# EasyEDA Pro project 红外对管感应模块.eprj

# Schematic Schematic2
Page Name: p1_1; Project Name: 红外对管感应模块; Schematic Name: Schematic2; Update Date: 2023-04-21; Company: 嘉立创EDA; Page Size: A4; Version: V1.0
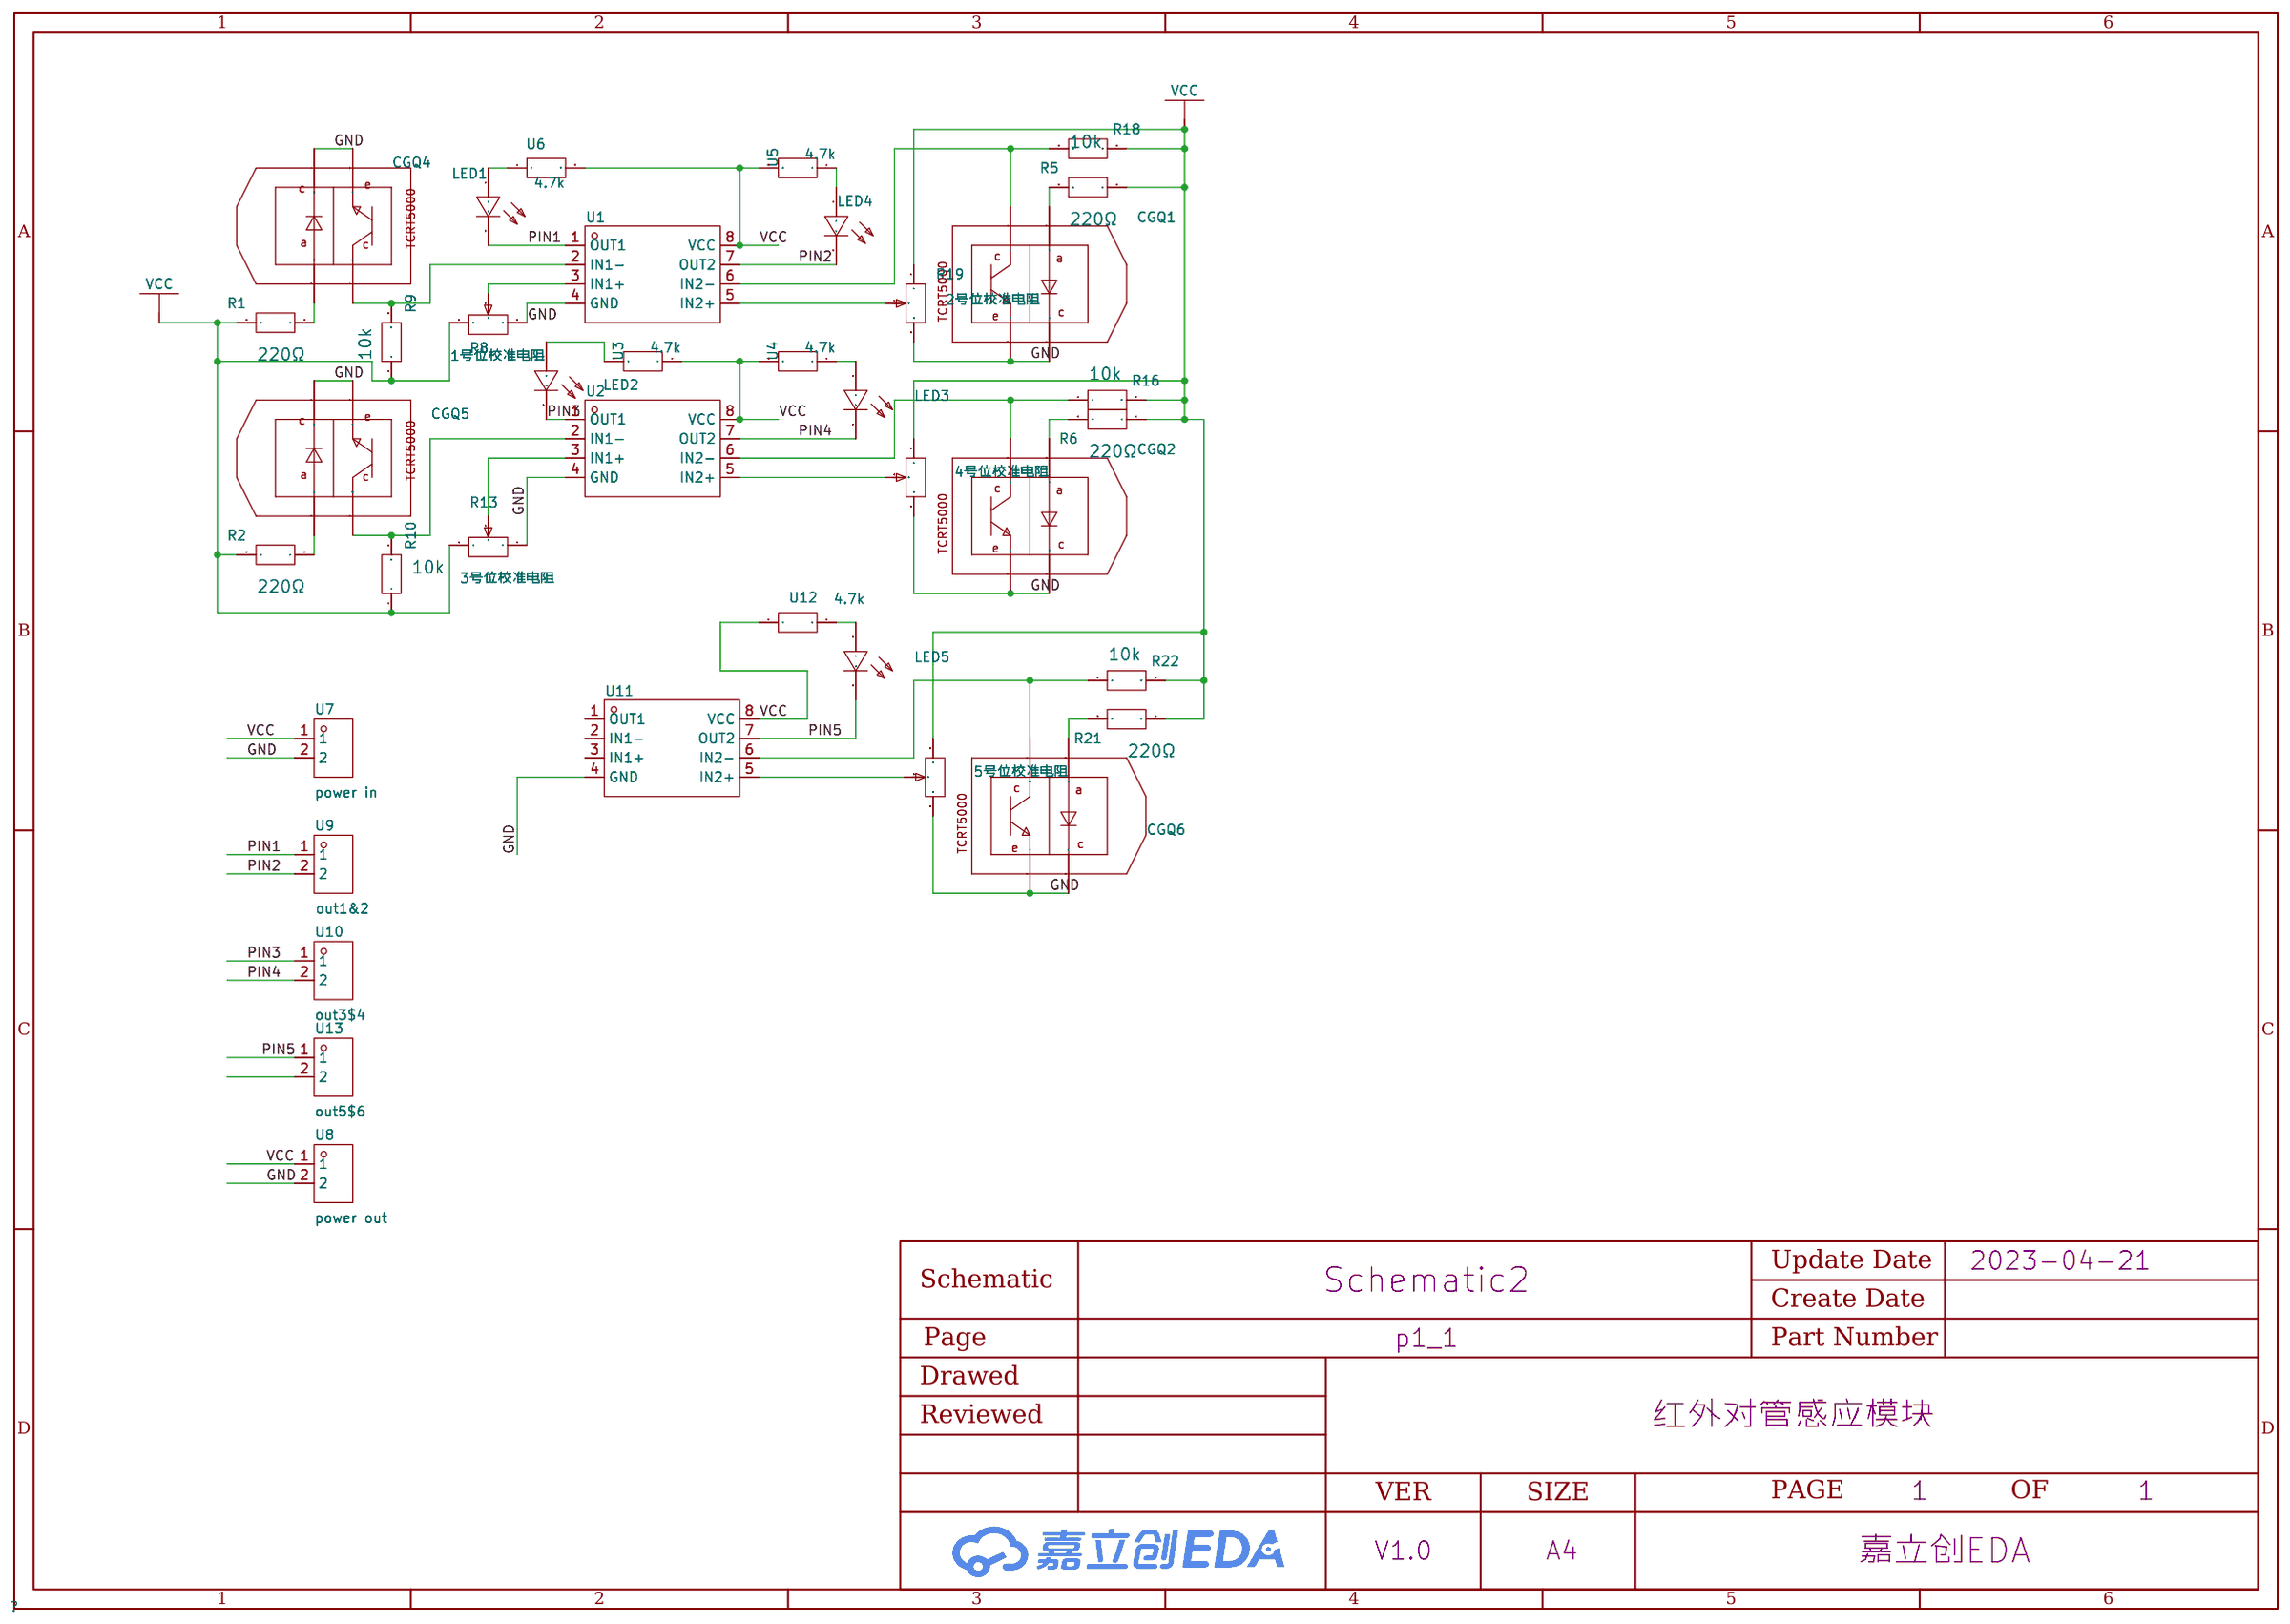
[diagram p0: schematic sheet]

## Parts
CGQ1  -  [opto-th_tcrt5000l]
CGQ2  -  [opto-th_tcrt5000l]
CGQ4  -  [opto-th_tcrt5000l]
CGQ5  -  [opto-th_tcrt5000l]
CGQ6  -  [opto-th_tcrt5000l]
LED1  -  [led-th_bd3.8-p2.54-fd]
LED2  -  [led-th_bd3.8-p2.54-fd]
LED3  -  [led-th_bd3.8-p2.54-fd]
LED4  -  [led-th_bd3.8-p2.54-fd]
LED5  -  [led-th_bd3.8-p2.54-fd]
R1  220Ω  [直插电阻]
R2  220Ω  [直插电阻]
R5  220Ω  [直插电阻]
R6  220Ω  [直插电阻]
R8  1号位校准电阻  [res-adj-th_3296w]
R9  10k  [直插电阻]
R10  10k  [直插电阻]
R13  3号位校准电阻  [res-adj-th_3296w]
R16  10k  [直插电阻]
R18  10k  [直插电阻]
R19  2号位校准电阻  [res-adj-th_3296w]
R20  4号位校准电阻  [res-adj-th_3296w]
R21  220Ω  [直插电阻]
R22  10k  [直插电阻]
R23  5号位校准电阻  [res-adj-th_3296w]
U1  -  [dip-8_l9.7-w6.4-p2.54-ls7.6-bl]
U2  -  [dip-8_l9.7-w6.4-p2.54-ls7.6-bl]
U3  4.7k  [直插电阻]
U4  4.7k  [直插电阻]
U5  4.7k  [直插电阻]
U6  4.7k  [直插电阻]
U7  power in  [hdr-th_2p-p2.54-v-m-1]
U8  power out  [hdr-th_2p-p2.54-v-m-1]
U9  out1&2  [hdr-th_2p-p2.54-v-m-1]
U10  out3$4  [hdr-th_2p-p2.54-v-m-1]
U11  -  [dip-8_l9.7-w6.4-p2.54-ls7.6-bl]
U12  4.7k  [直插电阻]
U13  out5$6  [hdr-th_2p-p2.54-v-m-1]

## Library data of the parts
CGQ1 CGQ2 CGQ4-CGQ6 = TCRT5000L: 950 nm 60 mA Through Hole Reflective Optical Sensor with Transistor Output; Supplier Part: C24085; Manufacturer: VISHAY(威世); Supplier Footprint: Through Hole; Datasheet: https://atta.szlcsc.com/upload/public/pdf/source/20150821/1457707346389.pdf; Supplier: LCSC
LED1-LED5 = 204-10SDRD/S530-A3-L: 发光颜色:红灯;; LCSC Part Name: 3MM  红发红光; Supplier Part: C84774; Manufacturer: EVERLIGHT(台湾亿光); Supplier Footprint: 插件; JLCPCB Part Class: Extended Part; Datasheet: https://atta.szlcsc.com/upload/public/pdf/source/20170717/C84774_1500286941158822251.pdf; Supplier: LCSC; Emitted Color: 红灯
R1 R2 R5 R6 R21 = 直插电阻: 220
R8 R13 R19 R20 R23 = 精密可调电阻 3296W-1-304(300K): LCSC Part Name: 精密可调电阻  3296W-1-304(300K); Supplier Part: C62174; Supplier Footprint: VR-3296W; Datasheet: https://atta.szlcsc.com/upload/public/pdf/source/20151126/1457707595819.pdf; Supplier: LCSC
R9 = 直插电阻
R10 R16 R18 R22 = 直插电阻10k
U1 U2 U11 = LM393N: 比较器组数:-;电源电压:-;各通道供电电流:-;输出类型:-;传播延迟:-;; LCSC Part Name: 双路差动比较器; Supplier Part: C725322; Manufacturer: HGSEMI(华冠); Supplier Footprint: DIP-8; Datasheet: https://atta.szlcsc.com/upload/public/pdf/source/20200820/C725322_C46EBBBE971B817B9F055C15254D1754.pdf; Supplier: LCSC
U3-U6 U12 = OX472KE: 电阻类型:陶瓷电阻;阻值:4.7k;精度:±10%;功率:1W;温度系数:-1600ppm/~-1000ppm/;工作温度范围:-40~+220;; LCSC Part Name: 4.7k ±10% 1W; Supplier Part: C2641721; Manufacturer: Ohmite; Supplier Footprint: 轴向引线,5.5x16.5mm; Datasheet: https://atta.szlcsc.com/upload/public/pdf/source/20210702/B1DB536FBEB5B0B19FA106C617F6E1C9.pdf; Supplier: LCSC; Type: 陶瓷电阻; Tolerance: ±10%; Power(Watts): 1W; Temperature Coefficient: -1600ppm/~-1000ppm/; Operating Temperature Range: -40~+220
U7-U10 U13 = HDR1X2: Supplier Part: C9900014921; Supplier Footprint: 排针; Datasheet: https://atta.szlcsc.comnull; Supplier: LCSC

## Nets
GND: CGQ1.2(E) CGQ1.4(C) CGQ2.2(E) CGQ2.4(C) CGQ4.2(E) CGQ4.4(C) CGQ5.2(E) CGQ5.4(C) CGQ6.2(E) CGQ6.4(C) R8.1 R13.1 R19.3 R20.3 R23.3 U1.4(GND) U2.4(GND) U7.2 U8.2 U11.4(GND)
VCC: R1.2 R2.2 R5.1 R6.1 R8.3 R9.1 R10.1 R13.3 R16.2 R18.2 R19.1 R20.1 R21.1 R22.2 R23.1 U1.8(VCC) U2.8(VCC) U3.1 U4.2 U5.2 U6.2 U7.1 U8.1 U11.8(VCC) U12.2
PIN1: LED1.2(C) U1.1(OUT1) U9.1
PIN2: LED4.2(C) U1.7(OUT2) U9.2
PIN3: LED2.2(C) U2.1(OUT1) U10.1
PIN4: LED3.2(C) U2.7(OUT2) U10.2
PIN5: LED5.2(C) U11.7(OUT2) U13.1
$3N2055: CGQ4.3(A) R1.1
$3N2059: CGQ5.3(A) R2.1
$3N2549: CGQ1.3(A) R5.2
$3N2554: CGQ2.3(A) R6.2
$3N2706: CGQ4.1(C) R9.2 U1.2(IN1-)
$3N4107: CGQ5.1(C) R10.2 U2.2(IN1-)
$3N4588: R13.2 U2.3(IN1+)
$3N7184: CGQ2.1(C) R16.1 U2.6(IN2-)
$3N7213: CGQ1.1(C) R18.1 U1.6(IN2-)
$3N7681: R19.2 U1.5(IN2+)
$3N9269: R20.2 U2.5(IN2+)
$3N15684: LED1.1(A) U6.1
$3N15894: LED2.1(A) U3.2
$3N16954: LED3.1(A) U4.1
$3N17558: LED4.1(A) U5.1
$3N17687: R8.2 U1.3(IN1+)
Net-(CGQ6-1): CGQ6.1(C) R22.1 U11.6(IN2-)
Net-(CGQ6-3): CGQ6.3(A) R21.2
Net-(LED5-1): LED5.1(A) U12.1
Net-(R23-2): R23.2 U11.5(IN2+)

Not connected (* = marked no-connect by the designer): U11 1(OUT1) 2(IN1-) 3(IN1+); U13 2

# Schematic Schematic3
Create Date: 2023-04-21; Page Name: P1; Project Name: 红外对管感应模块; Schematic Name: Schematic3; Update Date: 2023-04-23; Company: 嘉立创EDA; Page Size: A4; Version: V1.0
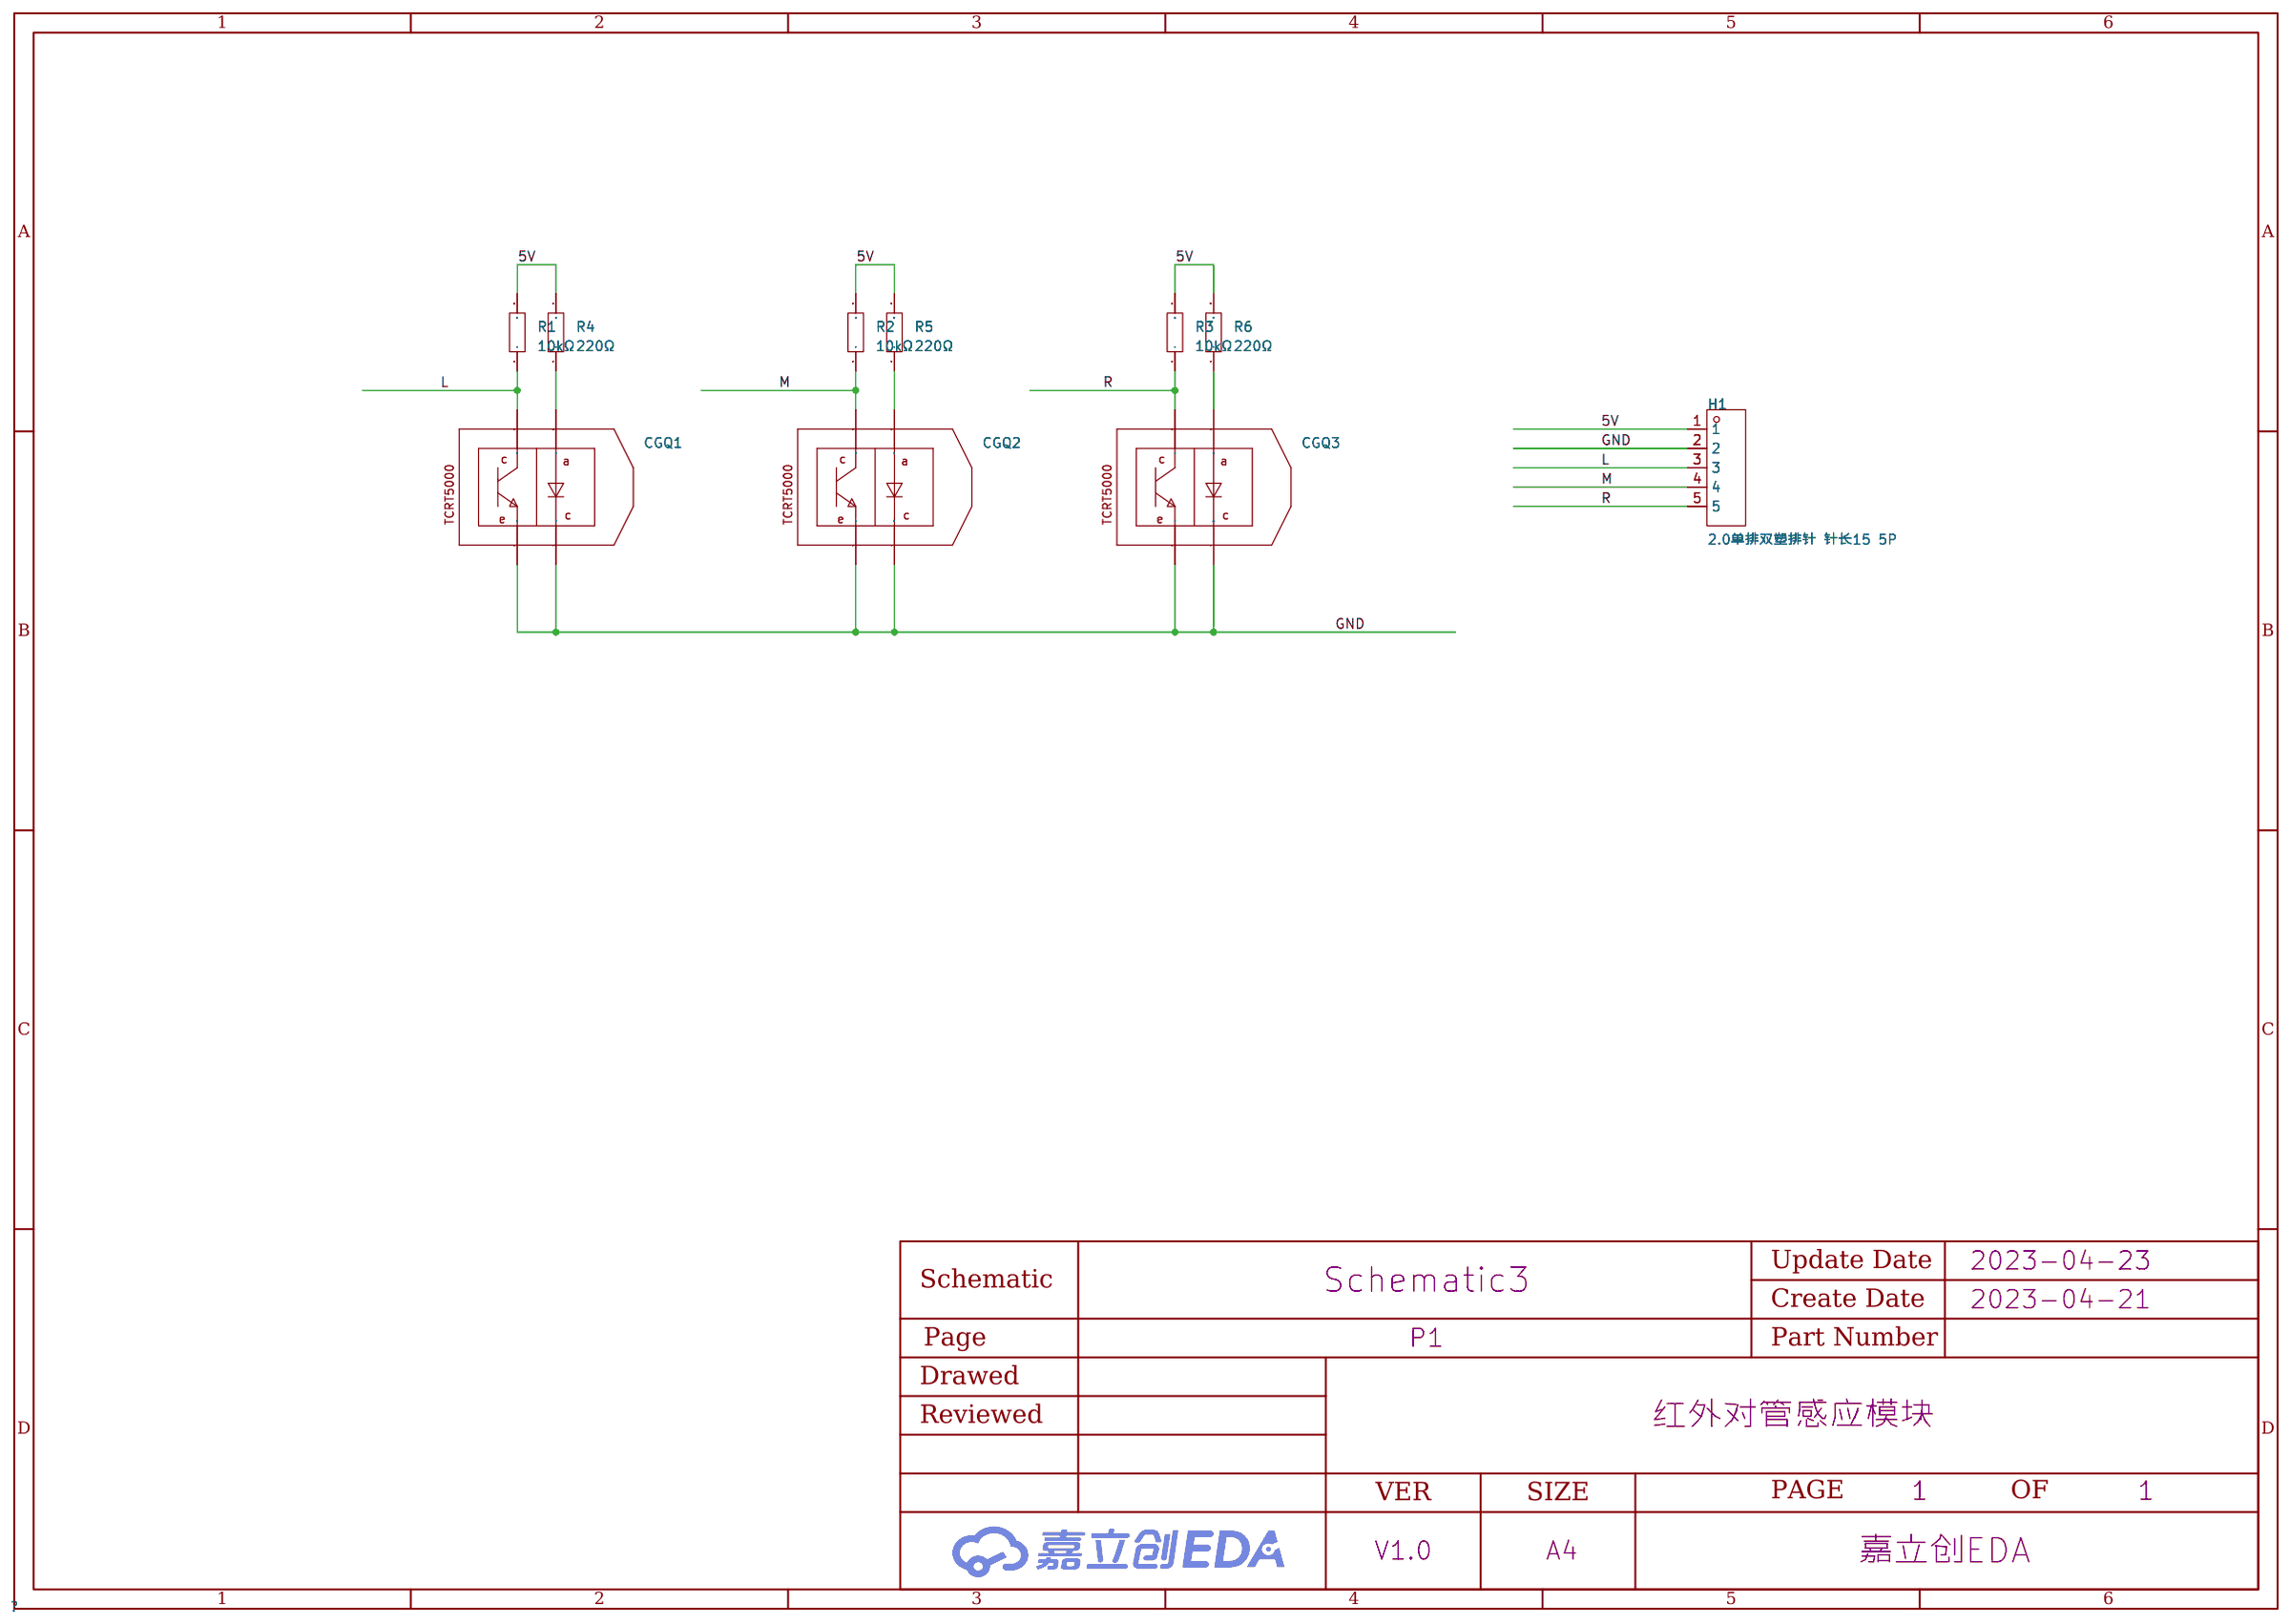
[diagram p1: schematic sheet]

## Parts
CGQ1  -  [opto-th_tcrt5000l]
CGQ2  -  [opto-th_tcrt5000l]
CGQ3  -  [opto-th_tcrt5000l]
H1  2.0单排双塑排针 针长15 5P  [HDR-TH_5P-P2.00-V-M]
R1  10kΩ  [Res_1/8W]
R2  10kΩ  [Res_1/8W]
R3  10kΩ  [Res_1/8W]
R4  220Ω  [Res_1/8W]
R5  220Ω  [Res_1/8W]
R6  220Ω  [Res_1/8W]

## Library data of the parts
CGQ1-CGQ3 = TCRT5000L: 950 nm 60 mA Through Hole Reflective Optical Sensor with Transistor Output; Supplier Part: C24085; Manufacturer: VISHAY(威世); Supplier Footprint: Through Hole; Datasheet: https://atta.szlcsc.com/upload/public/pdf/source/20150821/1457707346389.pdf; Supplier: LCSC
H1 = 2.0单排双塑排针 针长15 5P: Supplier Part: C9900020043; JLCPCB Part Class: Extended Part; Datasheet: https://atta.szlcsc.comnull; Supplier: LCSC
R1-R6 = Res_AXIAL-1/8W: Supplier Footprint: 轴向引线

## Nets
5V: H1.1 R1.2 R2.2 R3.2 R4.2 R5.2 R6.2
GND: CGQ1.2(E) CGQ1.4(C) CGQ2.2(E) CGQ2.4(C) CGQ3.2(E) CGQ3.4(C) H1.2
L: CGQ1.1(C) H1.3 R1.1
M: CGQ2.1(C) H1.4 R2.1
R: CGQ3.1(C) H1.5 R3.1
$1N2421: CGQ1.3(A) R4.1
$1N2492: CGQ2.3(A) R5.1
$1N2520: CGQ3.3(A) R6.1

# Board PCB
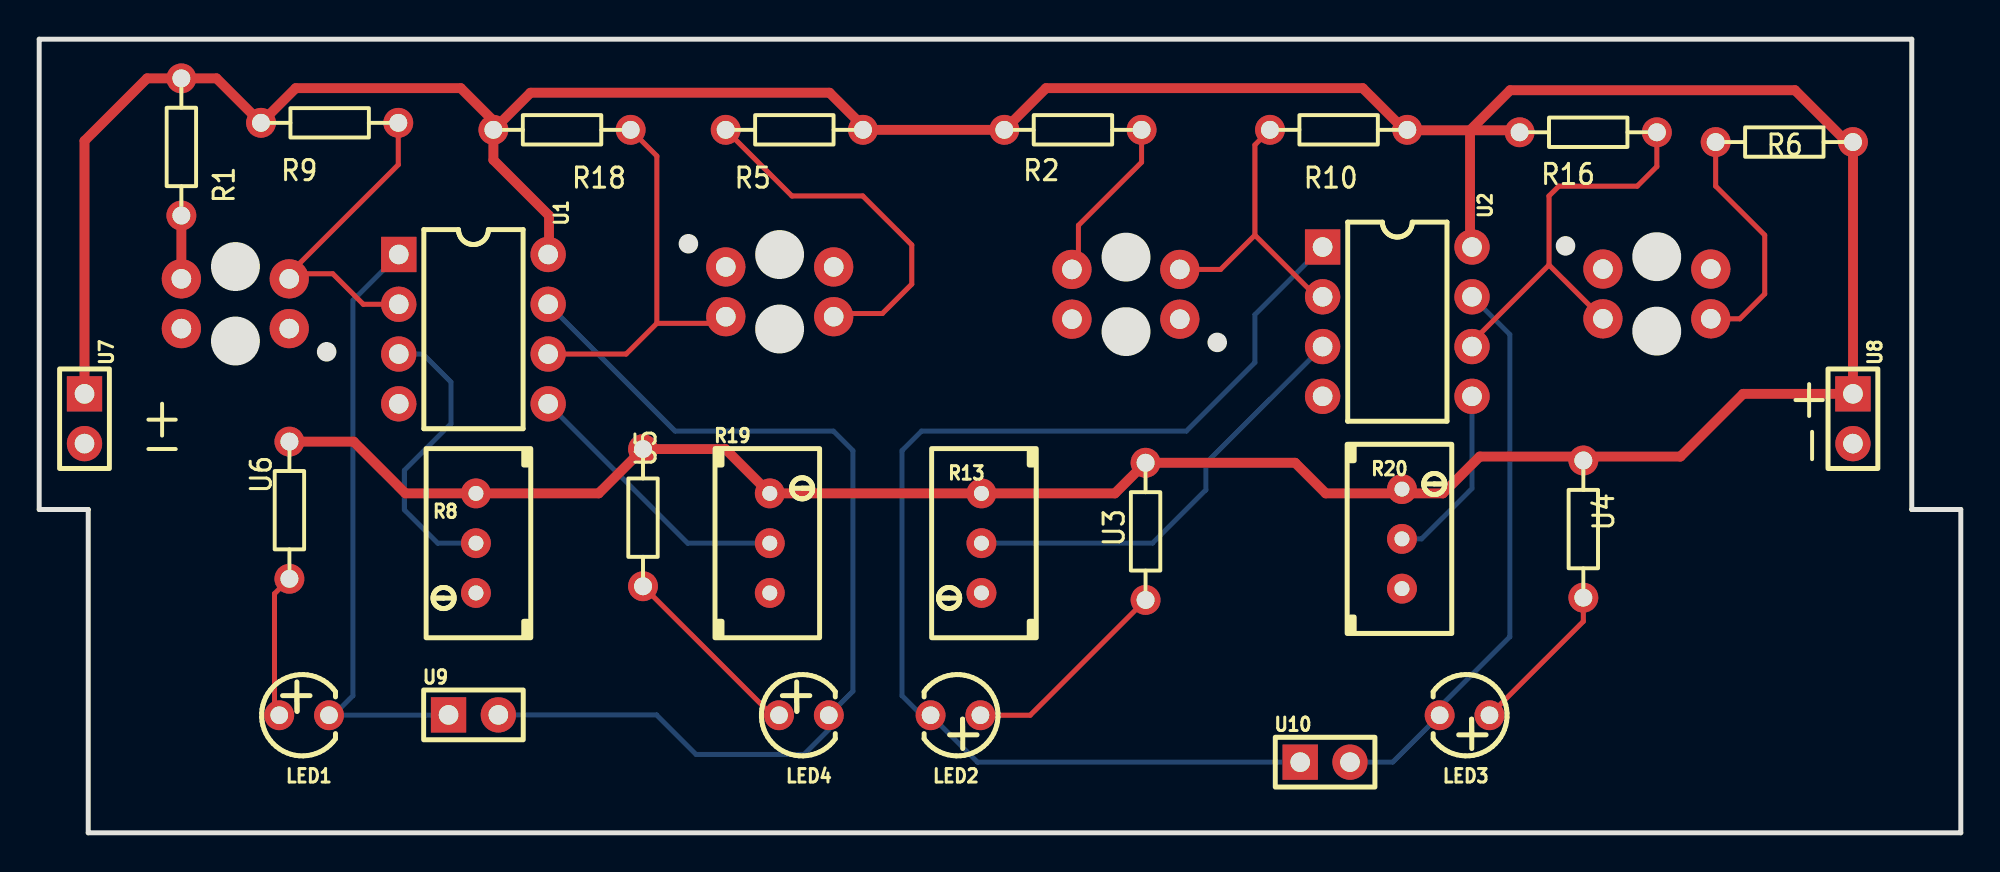
[diagram p2: board, top side]
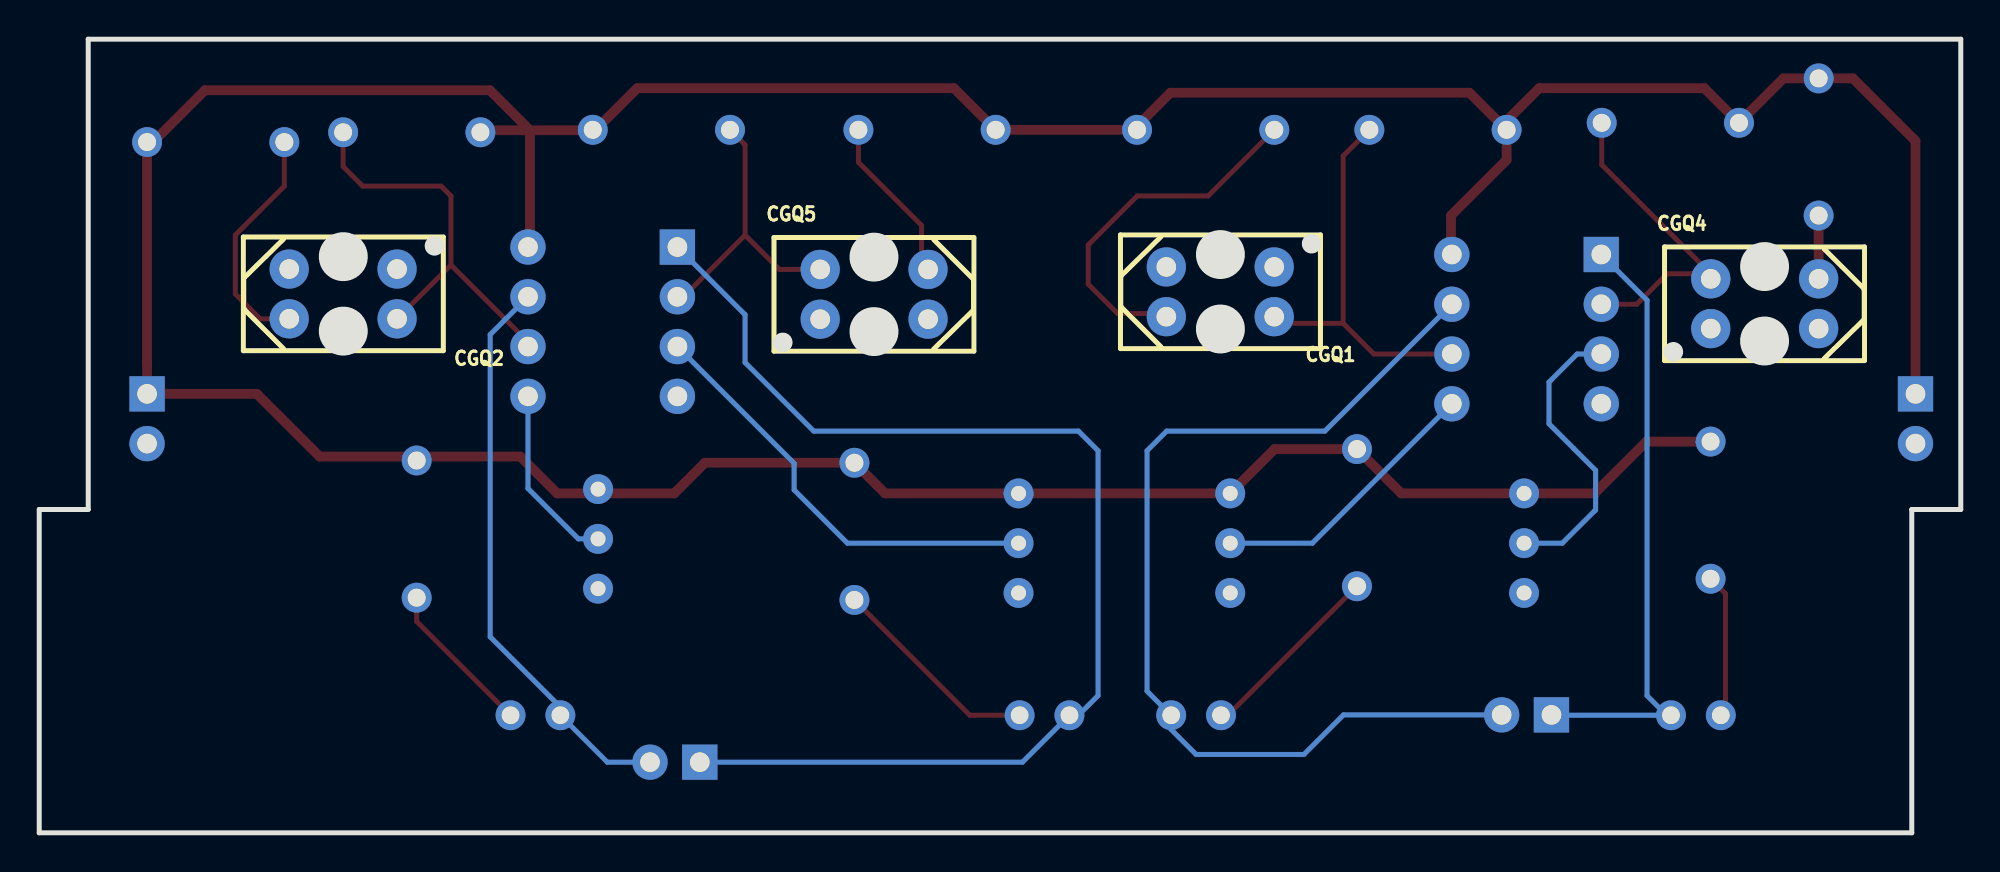
[diagram p3: board, bottom side, seen from below]

Outline 98 x 40.5 mm; copper layers: Top Layer, Bottom Layer. Coordinates in mm from the lower left corner of the outline.
Outline path: 0,40.5 95.5,40.5 95.5,16.5 98,16.5 98,0 2.5,0 2.5,16.5 0,16.5 0,40.5
Stack: Top Layer 0.035mm / 介电1 1.51mm FR4 er 4.5 / Bottom Layer 0.035mm

## Design rules (mm)
spacing safeClearance (default): track to track 0.152, other pairs 0.152 to 0.3
track width trackWidth (default): min 0.127, default 0.254, max 2.54
differential pair differentialPair (default): width min 0.127, default 0.254, max 2.54; gap min 0.152, default 0.152
via viaSize (default): diameter min 0.5, default 0.61, max 10; hole min 0.3, default 0.305, max 6

## Placement (name value [footprint] x y rotation side)
CGQ1  -  [opto-th_tcrt5000l]  37.77 27.61 0 bottom
CGQ2  -  [opto-th_tcrt5000l]  82.5 27.5 0 bottom
CGQ4  -  [opto-th_tcrt5000l]  10 27 180 bottom
CGQ5  -  [opto-th_tcrt5000l]  55.42 27.48 180 bottom
LED1  -  [led-th_bd3.8-p2.54-fd]  13.51 6 0 top
LED2  -  [led-th_bd3.8-p2.54-fd]  46.73 6 180 top
LED3  -  [led-th_bd3.8-p2.54-fd]  72.69 6 180 top
LED4  -  [led-th_bd3.8-p2.54-fd]  39 6 0 top
R1  220Ω  [直插电阻]  8 37 270 top
R2  220Ω  [直插电阻]  50.72 36.62 0 top
R5  220Ω  [直插电阻]  36.51 36.62 0 top
R6  220Ω  [直插电阻]  87 36 0 top
R8  1号位校准电阻  [res-adj-th_3296w]  22.27 14.78 180 top
R9  10k  [直插电阻]  16.81 35.48 180 top
R10  10k  [直插电阻]  64.27 36.62 0 top
R13  3号位校准电阻  [res-adj-th_3296w]  48.05 14.78 180 top
R16  10k  [直插电阻]  77 36.5 0 top
R18  10k  [直插电阻]  24.66 36.62 0 top
R19  2号位校准电阻  [res-adj-th_3296w]  37.26 14.78 0 top
R20  4号位校准电阻  [res-adj-th_3296w]  69.5 15 0 top
U1  -  [dip-8_l9.7-w6.4-p2.54-ls7.6-bl]  22.15 25.7 270 top
U2  -  [dip-8_l9.7-w6.4-p2.54-ls7.6-bl]  69.26 26.08 270 top
U3  4.7k  [直插电阻]  55.67 13.38 90 top
U4  4.7k  [直插电阻]  79.5 17.5 270 top
U5  4.7k  [直插电阻]  31.54 18.08 270 top
U6  4.7k  [直插电阻]  13.51 18.46 270 top
U7  power in  [hdr-th_2p-p2.54-v-m-1]  2.31 21.13 270 top
U8  power out  [hdr-th_2p-p2.54-v-m-1]  92.5 21.13 270 top
U9  out1&2  [hdr-th_2p-p2.54-v-m-1]  22.15 6.02 0 top
U10  out3$4  [hdr-th_2p-p2.54-v-m-1]  65.58 3.61 0 top

## Footprints (pads in the part's own frame, mm; a bottom-side part is the same pattern mirrored in y, then rotated)
dip-8_l9.7-w6.4-p2.54-ls7.6-bl
  rect 1.801x1.801 hole 1.001: 1(-3.81,-3.81)
  round 1.801 hole 1.001: 2(-1.27,-3.81) 3(1.27,-3.81) 4(3.81,-3.81) 5(3.81,3.81) 6(1.27,3.81) 7(-1.27,3.81) 8(-3.81,3.81)
hdr-th_2p-p2.54-v-m-1
  rect 1.8x1.8 hole 1: 1(-1.27,0)
  round 1.8 hole 1: 2(1.27,0)
led-th_bd3.8-p2.54-fd
  round 1.524 hole 0.9: 1(-1.27,0) 2(1.27,0)
opto-th_tcrt5000l
  round 1.999 hole 1.001: 1(-2.751,1.27) 2(-2.751,-1.27) 3(2.751,1.27) 4(2.751,-1.27)
res-adj-th_3296w
  round 1.524 hole 0.762: 1(0,2.54) 2(0,0) 3(0,-2.54)
直插电阻
  round 1.524 hole 0.914: 1(5.5,-0.75) 2(-1.5,-0.75)

## Nets
As in the schematic.

## Routing (per net, layer and track width the routed paths; a pad name or vN(x,y) marks a point on that pad's centre or on a via; arc(x,y) is an arc through that point)
VCC: length 227.5
  Top Layer w0.5: 72.97,35.85 69.79,35.85 R10.1 69.62,35.88 67.5,38 51.35,38 R2.2 R5.1 42.01,36.06 40.31,37.77 25.06,37.77 R18.2 ; 72.97,35.85 72.97,30 U2.8 ; 72.97,35.85 75.02,37.89 89.55,37.89 92.5,34.94 92.5,24 92.5,24 U8.1 86.9,22.4 83.7,19.2 73.47,19.2 71.59,17.32 65.61,17.32 64.05,18.88 U3.1 54.86,17.32 37.26,17.32 35,19.58 U5.2 28.53,17.32 18.68,17.32 16.04,19.96 U6.2 ; 72.97,35.85 75.4,35.85 R16.2 ; R18.2 23.16,36.34 21.5,38 13.08,38 R9.1 9.04,38.5 R1.2 5.5,38.5 2.31,35.31 U7.1 ; R18.2 23.16,34.34 26,31.5 26,29.56 U1.8
PIN1: length 31.3
  Bottom Layer w0.254: U9.1 20.86,6 15,6 ; U1.1 16,27.18 16,7 15,6 ; 15,6 14.78,5.78 ; 15,6 LED1.2
PIN2: length 51.6
  Bottom Layer w0.254: U1.7 32.43,20.5 40.5,20.5 41.5,19.5 41.5,7.23 LED4.2 40.27,5.27 39,4 33.5,4 31.48,6.02 U9.2
PIN3: length 61.4
  Bottom Layer w0.254: U10.1 47.85,3.61 LED2.2 45,6 44,7 44,19.5 45,20.5 58.5,20.5 62,24 62,26.44 U2.1
PIN4: length 29.2
  Bottom Layer w0.254: U2.7 75,25.43 75,10 71.42,6.42 LED3.2 69.03,3.61 U10.2
$3N2055: length 3
  Top Layer w0.5: R1.1 7.25,28.53 7.25,28.53
$3N2059: length 8.6
  Top Layer w0.254: R2.1 56.22,34.22 53,31 53,29.08 52.67,28.75
$3N2549: length 18.6
  Top Layer w0.254: R5.2 38.39,32.5 42,32.5 44.5,30 44.5,28 43,26.5 40.68,26.5 CGQ1.3
$3N2554: length 12.1
  Top Layer w0.254: R6.2 85.5,33 88,30.5 88,27.5 86.73,26.23 CGQ2.3
$3N2706: length 16.2
  Top Layer w0.254: U1.2 16.53,26.97 14.97,28.53 12.75,28.53 18.31,34.09 R9.2
$3N4107: length 15
  Top Layer w0.254: 62,30.5 65.15,27.35 U2.2 ; 62,30.5 60.25,28.75 58.17,28.75 ; 62,30.5 62,35.11 R10.2
$3N4588: length 22.4
  Bottom Layer w0.254: R13.2 56.78,14.78 59.5,17.5 59.5,18.86 U2.3
$3N7184: length 21.1
  Top Layer w0.254: R16.1 82.5,34 81.5,33 77.5,33 77,32.5 77,28.98 ; 77,28.98 CGQ2.1 ; 77,28.98 73.07,25.05 U2.6
$3N7213: length 20.3
  Top Layer w0.254: 31.5,26 34.68,26 CGQ1.1 ; 31.5,26 29.93,24.43 U1.6 ; 31.5,26 31.5,34.54 R18.1
$3N7681: length 14.2
  Bottom Layer w0.254: U1.5 33.07,14.78 R19.2
$3N9269: length 9.3
  Bottom Layer w0.254: U2.5 73.07,17.57 70.5,15 R20.2
$3N15684: length 7.4
  Top Layer w0.254: LED1.1 12,6.24 12,12.2 U6.1
$3N15894: length 10.9
  Top Layer w0.254: LED2.1 50.54,6 U3.2
$3N16954: length 8
  Top Layer w0.254: LED3.1 78.75,10.79 U4.1
$3N17558: length 9.7
  Top Layer w0.254: U5.1 37.38,6 LED4.1
$3N17687: length 15.1
  Bottom Layer w0.254: U1.3 19.57,24.43 21,23 21,20.87 18.62,18.5 18.62,16.48 20.32,14.78 R8.2

## Copper pours and planes (outline as drawn; the poured copper is in the pictures)
GND on Top Layer: -15,53 106.5,53 106.5,-13 -15,-13
GND on Bottom Layer: -11,50 114.5,50 114.5,-8.5 -11,-8.5

## Text on the board
Top Silkscreen Layer: + | -

# Board PCB5
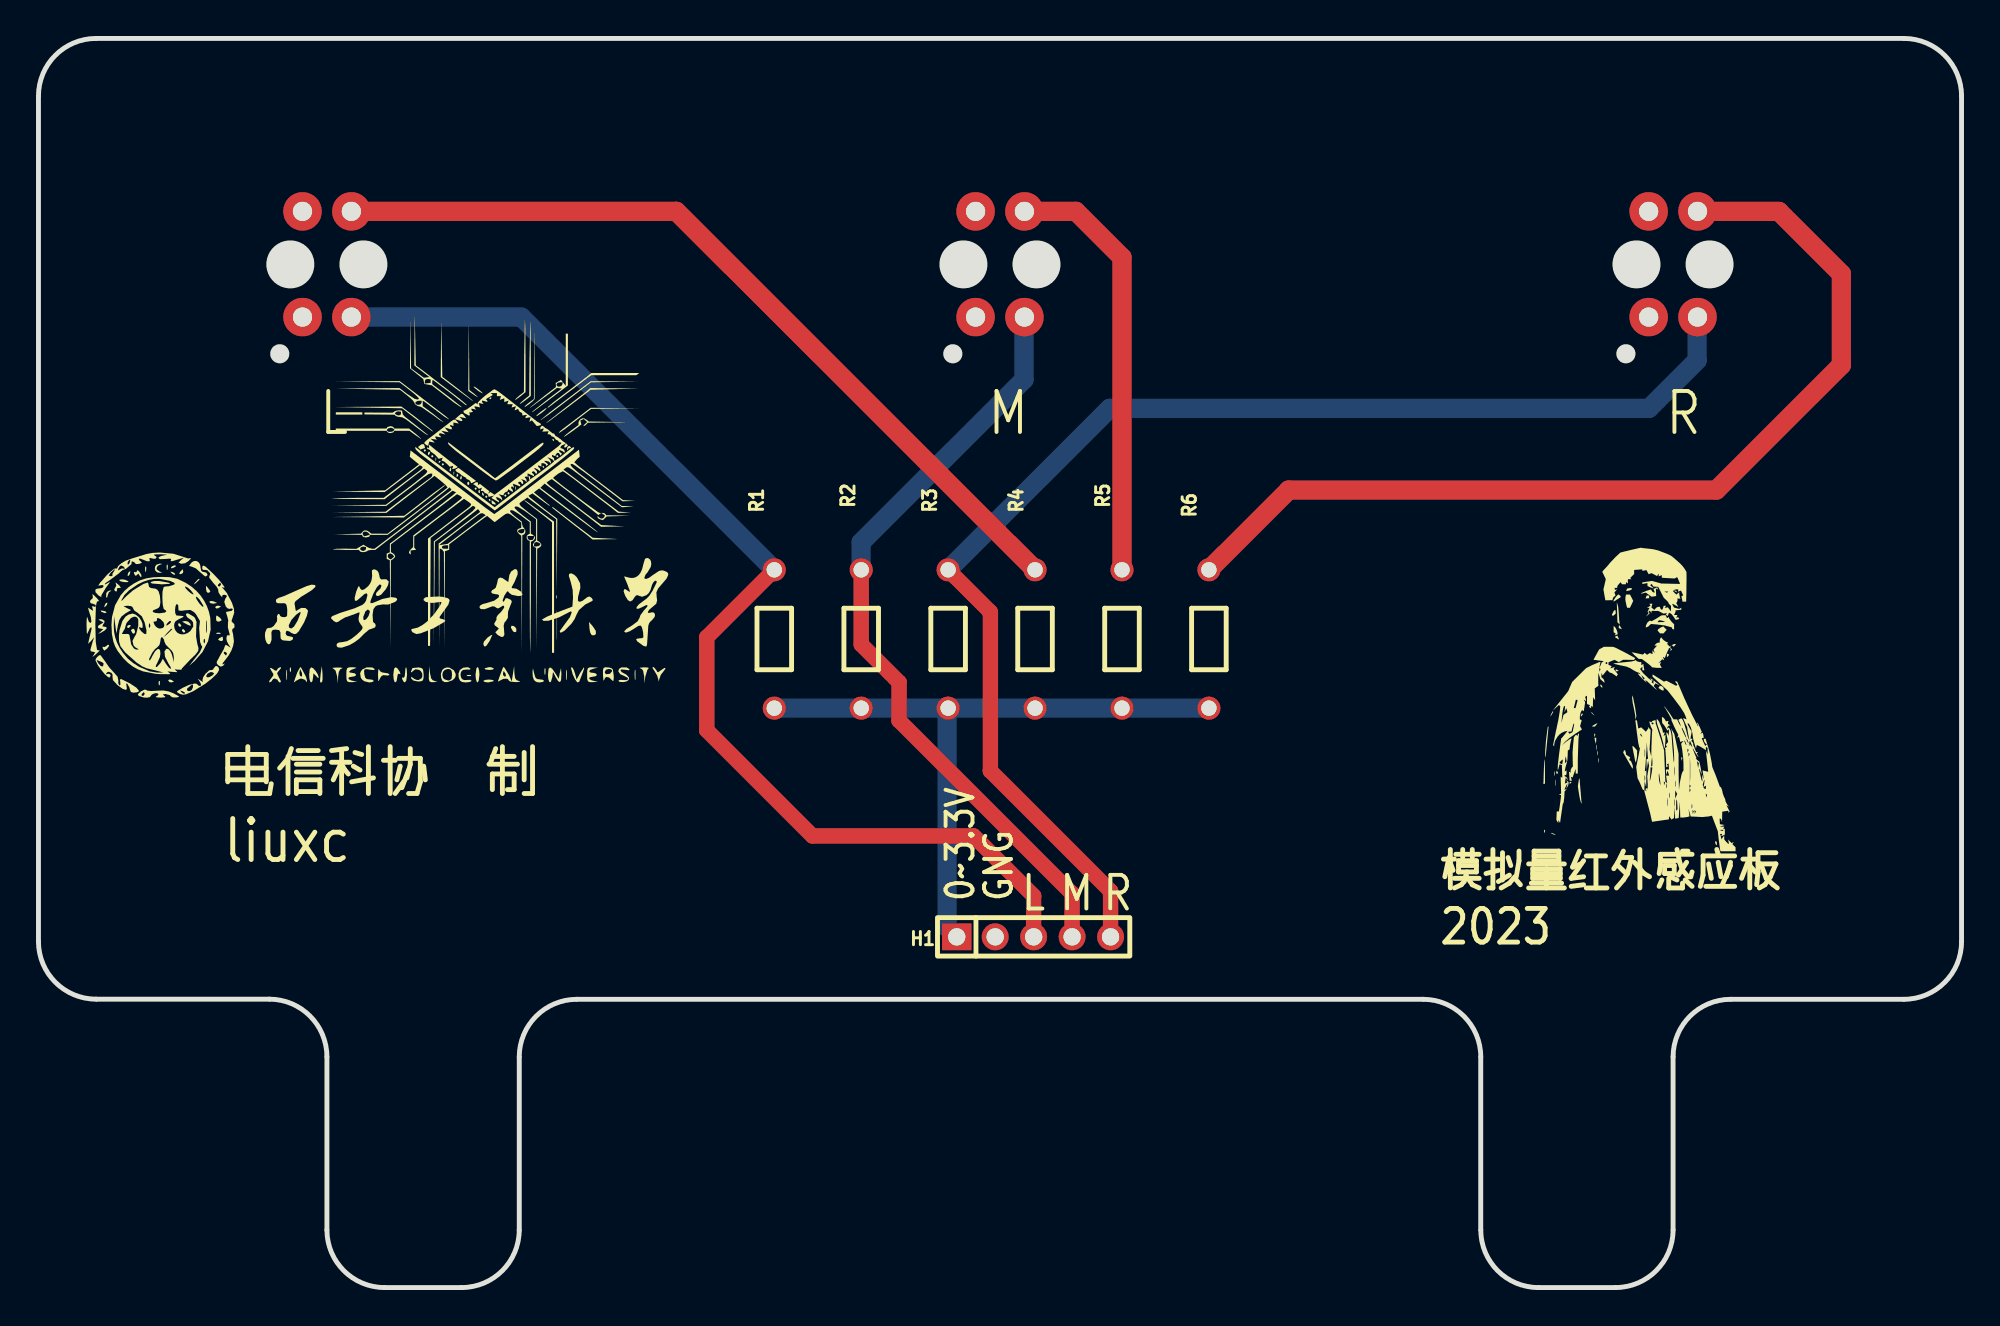
[diagram p4: board, top side]
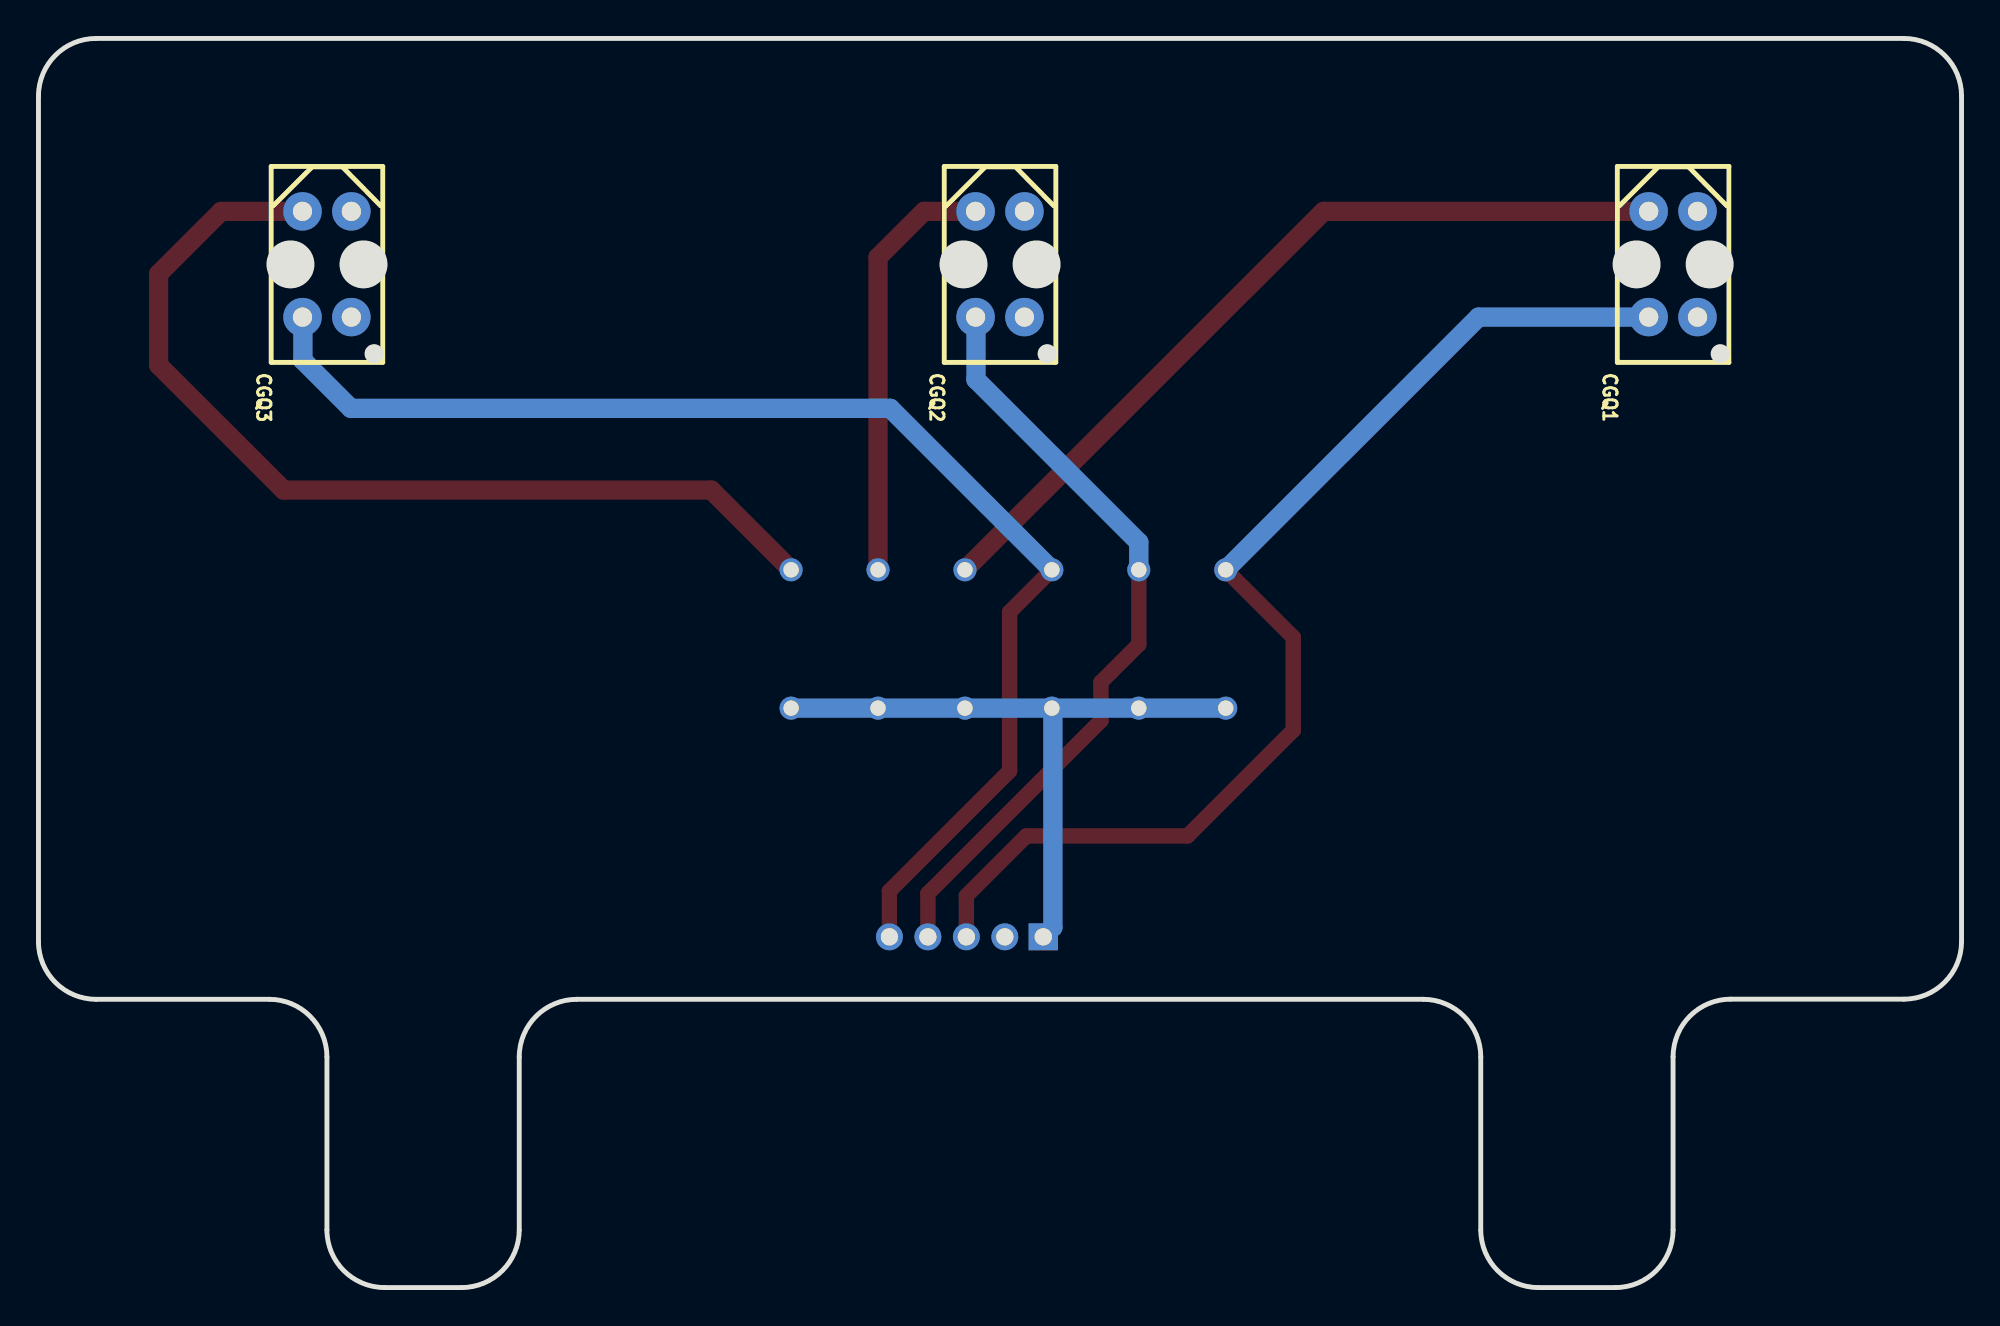
[diagram p5: board, bottom side, seen from below]

Outline 100 x 65 mm; copper layers: Top Layer, Bottom Layer. Coordinates in mm from the lower left corner of the outline.
Outline path: 0,62 arc(0.88,64.12) 3,65 97,65 arc(99.12,64.12) 100,62 100,18 arc(99.12,15.88) 97,15 88,15 arc(85.88,14.12) 85,12 85,3 arc(84.12,0.88) 82,0 78,0 arc(75.88,0.88) 75,3 75,12 arc(74.12,14.12) 72,15 28,15 arc(25.88,14.12) 25,12 25,3 arc(24.12,0.88) 22,0 18,0 arc(15.88,0.88) 15,3 15,12.01 arc(14.12,14.13) 12,15.01 3,15.01 arc(0.88,15.89) 0,18.01 0,62
Stack: Top Layer 0.035mm / Dielectric1 1.51mm FR4 er 4.5 / Bottom Layer 0.035mm

## Design rules (mm)
template: JLCPCB Capability(Two Layers Board)
spacing copperThickness1oz (default): track to track 0.102, other pairs 0.152 to 0.3
spacing copperThickness2oz: track to track 0.203, other pairs 0.152 to 0.3
track width copperThickness1oz (default): min 0.127, default 0.254, max 2.54
track width copperThickness2oz: min 0.203, default 0.254, max 2.54
differential pair differentialPair (default): width min 0.127, default 0.254, max 2.54; gap min 0.152, default 0.152
via viaSize (default): diameter min 0.5, default 0.61, max 10; hole min 0.3, default 0.305, max 6.3

## Placement (name value [footprint] x y rotation side)
CGQ1  -  [opto-th_tcrt5000l]  15 53.25 90 bottom
CGQ2  -  [opto-th_tcrt5000l]  50 53.25 90 bottom
CGQ3  -  [opto-th_tcrt5000l]  85 53.25 90 bottom
H1  2.0单排双塑排针 针长15 5P  [HDR-TH_5P-P2.00-V-M]  51.75 18.25 0 top
R1  10kΩ  [Res_1/8W]  38.2 33.75 270 top
R2  10kΩ  [Res_1/8W]  42.72 33.75 270 top
R3  10kΩ  [Res_1/8W]  47.24 33.75 270 top
R4  220Ω  [Res_1/8W]  51.76 33.75 270 top
R5  220Ω  [Res_1/8W]  56.28 33.75 270 top
R6  220Ω  [Res_1/8W]  60.8 33.75 270 top

## Footprints (pads in the part's own frame, mm; a bottom-side part is the same pattern mirrored in y, then rotated)
HDR-TH_5P-P2.00-V-M
  rect 1.524x1.4 hole 0.9: 1(-4,0)
  round 1.4 hole 0.9: 2(-2,0) 3(0,0) 4(2,0) 5(4,0)
opto-th_tcrt5000l
  round 1.999 hole 1.001: 1(-2.751,1.27) 2(-2.751,-1.27) 3(2.751,1.27) 4(2.751,-1.27)
Res_1/8W
  round 1.199 hole 0.8: 1(-3.599,0.063) 2(3.599,0.063)

## Nets
As in the schematic.

## Routing (per net, layer and track width the routed paths; a pad name or vN(x,y) marks a point on that pad's centre or on a via; arc(x,y) is an arc through that point)
5V: length 34.7
  Bottom Layer w1: R6.2 R5.2 R3.2 ; R3.2 47.25,30.1 47.25,18.75 H1.1 ; R3.2 R2.2 38.26,30.15
L: length 59.9
  Top Layer w0.8: 38.26,37.35 34.75,33.84 34.75,29 40.25,23.5 48.63,23.5 51.75,20.38 H1.3
  Bottom Layer w1: CGQ1.1 25.11,50.5 38.26,37.35
M: length 40.3
  Top Layer w0.8: H1.4 53.75,20.5 44.75,29.5 44.75,31.5 42.78,33.47 R2.1
  Bottom Layer w1: CGQ2.1 51.25,50.48 51.25,47.25 42.78,38.78 R2.1
R: length 68.3
  Top Layer w0.8: H1.5 55.75,20.63 49.5,26.88 49.5,35.15 R3.1
  Bottom Layer w1: CGQ3.1 86.25,50.48 86.25,48.25 83.75,45.75 55.7,45.75 R3.1
$1N2421: length 43.3
  Top Layer w1: CGQ1.3 33.17,56 51.82,37.35
$1N2492: length 22.3
  Top Layer w1: CGQ2.3 53.95,56 56.34,53.61 56.34,37.35
$1N2520: length 50.9
  Top Layer w1: 86.27,56 90.5,56 93.75,52.75 93.75,48 87.25,41.5 65.01,41.5 R6.1

## Copper pours and planes (outline as drawn; the poured copper is in the pictures)
GND on Top Layer: -3.25,68.75 110.25,68.75 110.25,-4.25 -3.25,-4.25
GND on Bottom Layer: -10.75,73 116.5,73 116.5,-11.25 -10.75,-11.25

## Text on the board
Top Silkscreen Layer: 0~3.3V | GNG | L | M | R | 模拟量红外感应板 / 2023 | 电信科协  制 / liuxc
